# EAGLE schematic TMC2130-Eval_v13 (EAGLE 6.2)

## Sheet 1 of 2
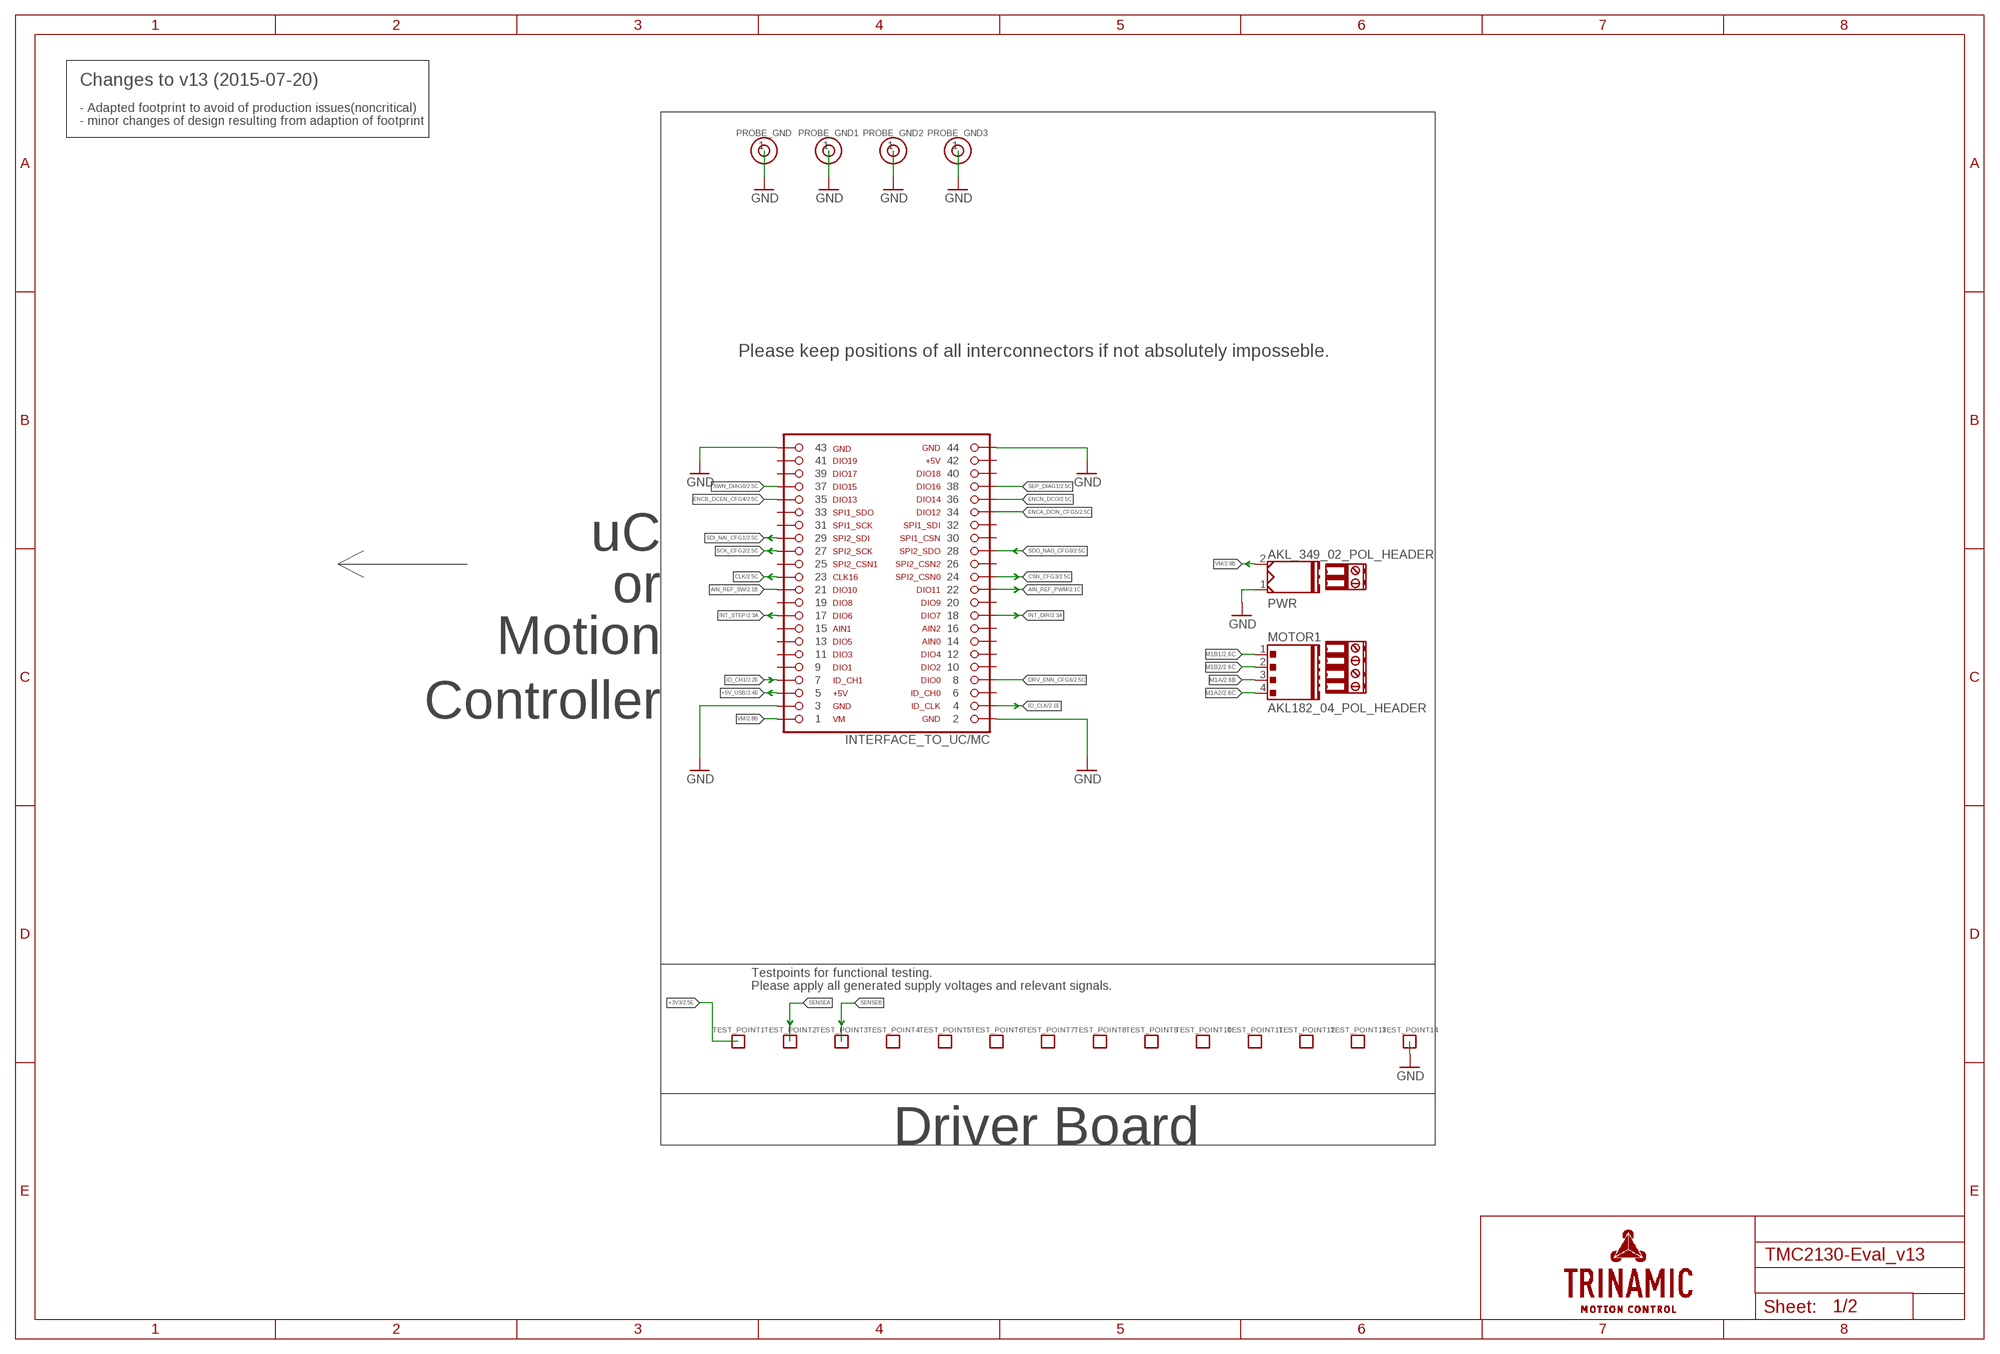
[diagram p0: schematic, sheet 1]

### Parts
INTERFACE_TO_UC/MC  FEMALE_HEADER_SMD_2.54_44_PINSHORTPADS_HOLES  [FEMALE_HEADER_SMD_254_44_PIN_SHORTPADS_HOLES]
MOTOR1  AKL182_04_POL_HEADER  [AKL169_04_POL]
PROBE_GND  NOT ASSEMBLED  1PIN_1ROW  [1PIN_1ROW_THT]
PROBE_GND1  NOT ASSEMBLED  1PIN_1ROW  [1PIN_1ROW_THT]
PROBE_GND2  NOT ASSEMBLED  1PIN_1ROW  [1PIN_1ROW_THT]
PROBE_GND3  NOT ASSEMBLED  1PIN_1ROW  [1PIN_1ROW_THT]
PWR  AKL_349_02_POL_HEADER  [AKL349_02_POL]
TERM1  AKL_330_2_POL_TERMINAL  [EXTRA_TERMINAL]
TERM2  AKL182_04_POL_TERMINAL  [EXTRA_TERMINAL]
TEST_POINT1  NOT ASSEMBLED  PAD_ROUND  [PAD_R1.2]
TEST_POINT2  NOT ASSEMBLED  PAD_ROUND  [PAD_R1.2]
TEST_POINT3  NOT ASSEMBLED  PAD_ROUND  [PAD_R1.2]
TEST_POINT4  NOT ASSEMBLED  PAD_ROUND  [PAD_R1.2]
TEST_POINT5  NOT ASSEMBLED  PAD_ROUND  [PAD_R1.2]
TEST_POINT6  NOT ASSEMBLED  PAD_ROUND  [PAD_R1.2]
TEST_POINT7  NOT ASSEMBLED  PAD_ROUND  [PAD_R1.2]
TEST_POINT8  NOT ASSEMBLED  PAD_ROUND  [PAD_R1.2]
TEST_POINT9  NOT ASSEMBLED  PAD_ROUND  [PAD_R1.2]
TEST_POINT10  NOT ASSEMBLED  PAD_ROUND  [PAD_R1.2]
TEST_POINT11  NOT ASSEMBLED  PAD_ROUND  [PAD_R1.2]
TEST_POINT12  NOT ASSEMBLED  PAD_ROUND  [PAD_R1.2]
TEST_POINT13  NOT ASSEMBLED  PAD_ROUND  [PAD_R1.2]
TEST_POINT14  NOT ASSEMBLED  PAD_ROUND  [PAD_R1.2]

### Nets
+3V3: TEST_POINT1.P$1 ; also sheet 2
+5V_USB: INTERFACE_TO_UC/MC.5 ; also sheet 2
AIN_REF_PWM: INTERFACE_TO_UC/MC.22 ; also sheet 2
AIN_REF_SW: INTERFACE_TO_UC/MC.21 ; also sheet 2
CLK: INTERFACE_TO_UC/MC.23 ; also sheet 2
CSN_CFG3: INTERFACE_TO_UC/MC.24 ; also sheet 2
DRV_ENN_CFG6: INTERFACE_TO_UC/MC.8 ; also sheet 2
ENCA_DCIN_CFG5: INTERFACE_TO_UC/MC.34 ; also sheet 2
ENCB_DCEN_CFG4: INTERFACE_TO_UC/MC.35 ; also sheet 2
ENCN_DCO: INTERFACE_TO_UC/MC.36 ; also sheet 2
GND: INTERFACE_TO_UC/MC.2 INTERFACE_TO_UC/MC.3 INTERFACE_TO_UC/MC.43 INTERFACE_TO_UC/MC.44 PROBE_GND1.1 PROBE_GND2.1 PROBE_GND3.1 PROBE_GND.1 PWR.1 TEST_POINT14.P$1 ; also sheet 2
ID_CH1: INTERFACE_TO_UC/MC.7 ; also sheet 2
ID_CLK: INTERFACE_TO_UC/MC.4 ; also sheet 2
INT_DIR: INTERFACE_TO_UC/MC.18 ; also sheet 2
INT_STEP: INTERFACE_TO_UC/MC.17 ; also sheet 2
M1A: MOTOR1.3 ; also sheet 2
M1A2: MOTOR1.4 ; also sheet 2
M1B1: MOTOR1.1 ; also sheet 2
M1B2: MOTOR1.2 ; also sheet 2
SCK_CFG2: INTERFACE_TO_UC/MC.27 ; also sheet 2
SDI_NAI_CFG1: INTERFACE_TO_UC/MC.29 ; also sheet 2
SDO_NAO_CFG0: INTERFACE_TO_UC/MC.28 ; also sheet 2
SENSEA: TEST_POINT2.P$1 ; also sheet 2
SENSEB: TEST_POINT3.P$1 ; also sheet 2
SEP_DIAG1: INTERFACE_TO_UC/MC.38 ; also sheet 2
SWN_DIAG0: INTERFACE_TO_UC/MC.37 ; also sheet 2
VM: INTERFACE_TO_UC/MC.1 PWR.2 ; also sheet 2
Unconnected: INTERFACE_TO_UC/MC.6 INTERFACE_TO_UC/MC.9 INTERFACE_TO_UC/MC.10 INTERFACE_TO_UC/MC.11 INTERFACE_TO_UC/MC.12 INTERFACE_TO_UC/MC.13 INTERFACE_TO_UC/MC.14 INTERFACE_TO_UC/MC.15 INTERFACE_TO_UC/MC.16 INTERFACE_TO_UC/MC.19 INTERFACE_TO_UC/MC.20 INTERFACE_TO_UC/MC.25 INTERFACE_TO_UC/MC.26 INTERFACE_TO_UC/MC.30 INTERFACE_TO_UC/MC.31 INTERFACE_TO_UC/MC.32 INTERFACE_TO_UC/MC.33 INTERFACE_TO_UC/MC.39 INTERFACE_TO_UC/MC.40 INTERFACE_TO_UC/MC.41 INTERFACE_TO_UC/MC.42 TEST_POINT4.P$1 TEST_POINT5.P$1 TEST_POINT6.P$1 TEST_POINT7.P$1 TEST_POINT8.P$1 TEST_POINT9.P$1 TEST_POINT10.P$1 TEST_POINT11.P$1 TEST_POINT12.P$1 TEST_POINT13.P$1

### Notes on the sheet
- Changes to v13 (2015-07-20)
- - Adapted footprint to avoid of production issues(noncritical)
- - minor changes of design resulting from adaption of footprint
- Please keep positions of all interconnectors if not absolutely imposseble.
- uC
- or
- Motion
- Controller
- Testpoints for functional testing.
- Please apply all generated supply voltages and relevant signals.
- Driver Board

## Sheet 2 of 2
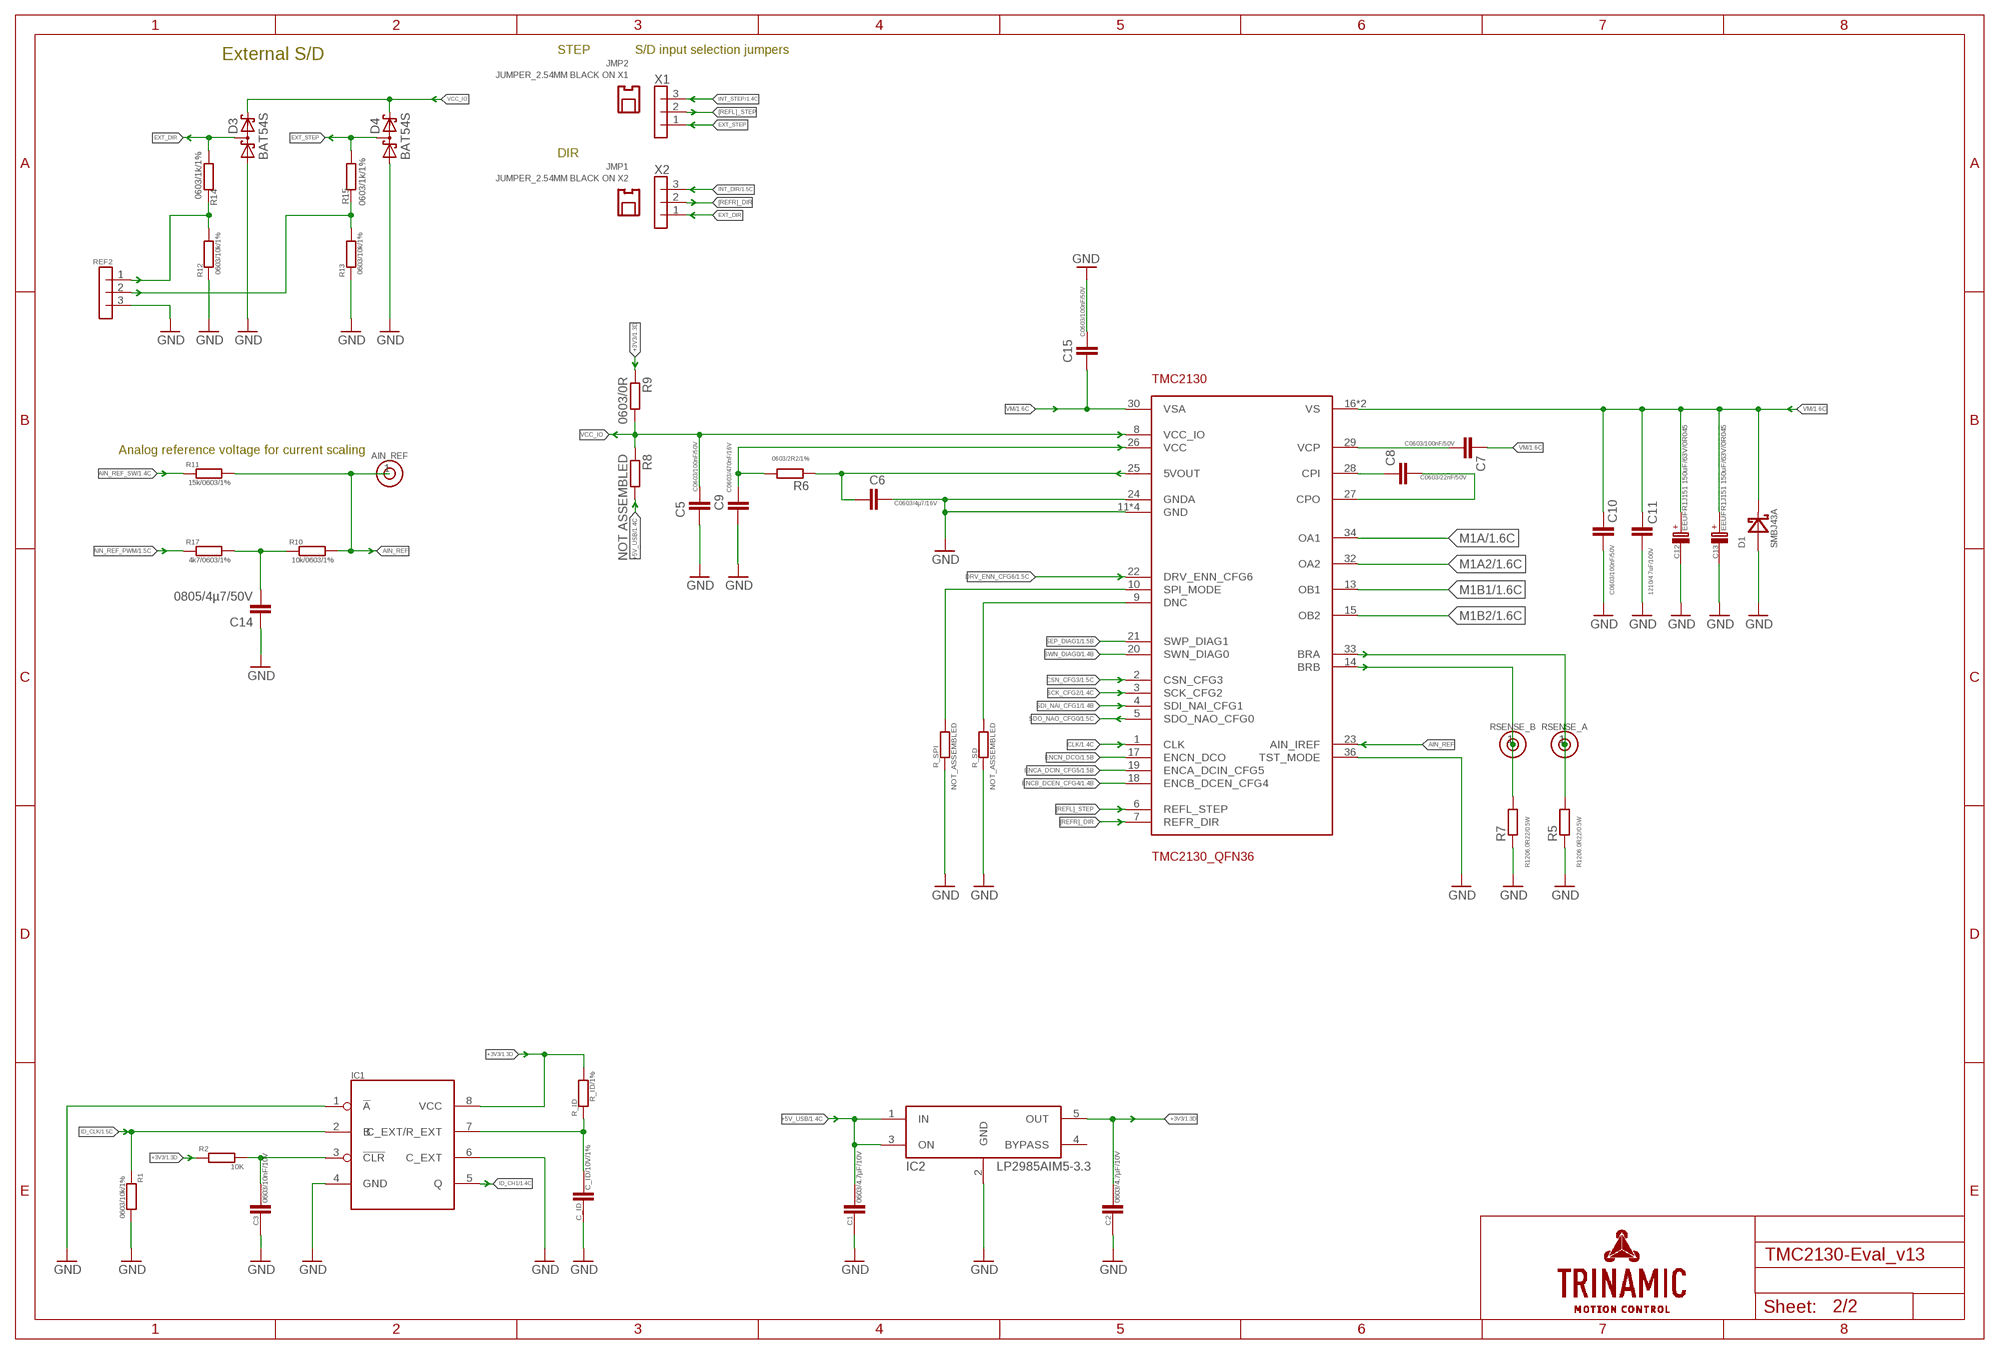
[diagram p1: schematic, sheet 2]

### Parts
AIN_REF  NOT ASSEMBLED  1PIN_1ROW  [1PIN_1ROW_THT]
C1  0603/4.7µF/10V  RCL_C/0603  [RCL_0603]
C2  0603/4.7µF/10V  RCL_C/0603  [RCL_0603]
C3  0603/10nF/10V  RCL_C/0603  [RCL_0603]
C5  C0603/100nF/50V  C-EUC0603  [C0603]
C6  C0603/4µ7/16V  C-EUC0603  [C0603]
C7  C0603/100nF/50V  C-EUC0603  [C0603]
C8  C0603/22nF/50V  C-EUC0603  [C0603]
C9  C0603/470nF/16V  C-EUC0603  [C0603]
C10  C0603/100nF/50V  C-EUC0603  [C0603]
C11  1210/4.7uF/100V  C-EUC1210  [C1210]
C12  EEUFR1J151 150uF/63V/0R045  C_POL  [C_POL_RAD_THT_5X10X12.5]
C13  EEUFR1J151 150uF/63V/0R045  C_POL  [C_POL_RAD_THT_5X10X12.5]
C14  0805/4µ7/50V  C-EUC0805  [C0805]
C15  C0603/100nF/50V  C-EUC0603  [C0603]
C_ID  C_ID/10V/1%  RCL_C/0603  [RCL_0603]
D1  SMBJ43A  SMBJ  [SMB]
D3  BAT54S  [SOT23]
D4  BAT54S  [SOT23]
IC1  SN74LVC1G123DCTR  [SN74LVC1G123DCTR]
IC2  LP2985AIM5-3.3  [SOT23-5]
JMP1  JUMPER_2.54MM BLACK ON X2  JUMPER_2.54MM  [EXTRA_TERMINAL]
JMP2  JUMPER_2.54MM BLACK ON X1  JUMPER_2.54MM  [EXTRA_TERMINAL]
R1  0603/10k/1%  RCL_R/0603  [RCL_0603]
R2  10K  RCL_R/0603  [RCL_0603]
R5  R1206,0R22/0.5W  R-EU_R1206  [R1206]
R6  0603/2R2/1%  R-EU_R0603  [R0603]
R7  R1206,0R22/0.5W  R-EU_R1206  [R1206]
R8  NOT ASSEMBLED  R-EU_R0603  [R0603]
R9  0603/0R  R-EU_R0603  [R0603]
R10  10k/0603/1%  RCL_R/0603  [RCL_0603]
R11  15k/0603/1%  RCL_R/0603  [RCL_0603]
R12  0603/10k/1%  R/0603  [0603]
R13  0603/10k/1%  R/0603  [0603]
R14  0603/1k/1%  R/0603  [0603]
R15  0603/1k/1%  R/0603  [0603]
R17  4k7/0603/1%  RCL_R/0603  [RCL_0603]
R_ID  R_ID/1%  RCL_R/0603  [RCL_0603]
R_SD  NOT_ASSEMBLED  RCL_R/0603  [RCL_0603]
R_SPI  NOT_ASSEMBLED  RCL_R/0603  [RCL_0603]
REF2  MALE HEADER 2.54  3PIN_1ROWTHT  [3PIN_1ROW_2,54_THT]
RSENSE_A  NOT ASSEMBLED  1PIN_1ROW  [1PIN_1ROW_THT]
RSENSE_B  NOT ASSEMBLED  1PIN_1ROW  [1PIN_1ROW_THT]
TMC2130  TMC2130_QFN36  [QFN36]
X1  MALE HEADER 2.54  3PIN_1ROWTHT  [3PIN_1ROW_2,54_THT]
X2  MALE HEADER 2.54  3PIN_1ROWTHT  [3PIN_1ROW_2,54_THT]

### Nets
+3V3: C2.1 IC1.8(VCC) IC2.5(OUT) R2.1 R9.1 R_ID.2 ; also sheet 1
+5V_USB: C1.1 IC2.1(IN) IC2.3(ON) R8.2 ; also sheet 1
[REFL]_STEP: TMC2130.6(REFL_STEP) X1.2
[REFR]_DIR: TMC2130.7(REFR_DIR) X2.2
AIN_REF: AIN_REF.1 R10.2 R11.2 TMC2130.23(AIN_IREF)
AIN_REF_PWM: R17.1 ; also sheet 1
AIN_REF_SW: R11.1 ; also sheet 1
CLK: TMC2130.1(CLK) ; also sheet 1
CSN_CFG3: TMC2130.2(CSN_CFG3) ; also sheet 1
DRV_ENN_CFG6: TMC2130.22(DRV_ENN_CFG6) ; also sheet 1
ENCA_DCIN_CFG5: TMC2130.19(ENCA_DCIN_CFG5) ; also sheet 1
ENCB_DCEN_CFG4: TMC2130.18(ENCB_DCEN_CFG4) ; also sheet 1
ENCN_DCO: TMC2130.17(ENCN_DCO) ; also sheet 1
EXT_DIR: D3.3(C1A2) R14.2 X2.1
EXT_DIR_CON: R12.2 R14.1 REF2.1
EXT_STEP: D4.3(C1A2) R15.2 X1.1
EXT_STEP_CON: R13.2 R15.1 REF2.2
GND: C1.2 C2.2 C3.2 C5.2 C6.2 C9.1 C10.1 C11.2 C12.- C13.- C14.1 C15.1 C_ID.2 D1.A D3.1(A1) D4.1(A1) IC1.1(!A) IC1.4(GND) IC1.6(C_EXT) IC2.2(GND) R1.2 R5.1 R7.1 R12.1 R13.1 R_SD.1 R_SPI.1 REF2.3 TMC2130.11(GND) TMC2130.12(GND) TMC2130.24(GNDA) TMC2130.35(GND) TMC2130.36(TST_MODE) TMC2130.GND_PAD(GND) ; also sheet 1
ID_CH1: IC1.5(Q) ; also sheet 1
ID_CLK: IC1.2(B) R1.1 ; also sheet 1
INT_DIR: X2.3 ; also sheet 1
INT_STEP: X1.3 ; also sheet 1
M1A: TMC2130.34(OA1) ; also sheet 1
M1A2: TMC2130.32(OA2) ; also sheet 1
M1B1: TMC2130.13(OB1) ; also sheet 1
M1B2: TMC2130.15(OB2) ; also sheet 1
N$1: C3.1 IC1.3(!CLR) R2.2
N$2: C_ID.1 IC1.7(C_EXT/R_EXT) R_ID.1
N$3: R_SPI.2 TMC2130.10(SPI_MODE)
N$5: R_SD.2 TMC2130.9(DNC)
N$7: C6.1 R6.1 TMC2130.25(5VOUT)
N$8: C8.1 TMC2130.28(CPI)
N$9: C8.2 TMC2130.27(CPO)
N$10: C7.2 TMC2130.29(VCP)
N$11: C9.2 R6.2 TMC2130.26(VCC)
N$14: C14.2 R10.1 R17.2
SCK_CFG2: TMC2130.3(SCK_CFG2) ; also sheet 1
SDI_NAI_CFG1: TMC2130.4(SDI_NAI_CFG1) ; also sheet 1
SDO_NAO_CFG0: TMC2130.5(SDO_NAO_CFG0) ; also sheet 1
SENSEA: R5.2 RSENSE_A.1 TMC2130.33(BRA) ; also sheet 1
SENSEB: R7.2 RSENSE_B.1 TMC2130.14(BRB) ; also sheet 1
SEP_DIAG1: TMC2130.21(SWP_DIAG1) ; also sheet 1
SWN_DIAG0: TMC2130.20(SWN_DIAG0) ; also sheet 1
VCC_IO: C5.1 D3.2(C2) D4.2(C2) R8.1 R9.2 TMC2130.8(VCC_IO)
VM: C7.1 C10.2 C11.1 C12.+ C13.+ C15.2 D1.C TMC2130.16(VS) TMC2130.30(VSA) TMC2130.31(VS) ; also sheet 1
Unconnected: IC2.4(BYPASS)

### Notes on the sheet
- STEP | S/D input selection jumpers
- External S/D
- DIR
- Analog reference voltage for current scaling

## Library data of the parts
AIN_REF PROBE_GND PROBE_GND1-PROBE_GND3 RSENSE_A RSENSE_B = _TMC_TE_con:1PIN_1ROW
C1-C3 C_ID = TMC_EVAL_driver_TE_v01:RCL_C
C5-C11 C14 C15 = rcl:C-EU: CAPACITOR, European symbol
C12 C13 = _TMC_TE_RCL:C_POL
D1 = _TMC_TE_D:SMBJ
D3 D4 = Trinamic:BAT54S: SOT23, BAT54S, Double Schottky diode 30V 200mA Copied from diode.lbr and edited for Artec use 23-08-13 Pin connection corrected 2011-05-04 Source: Fairchild .. BAT54.pdf; ADGPN: 3522154300; DATASHEET: http://www.nxp.com/documents/data_sheet/BAT54_SERIES.pdf; MANUF-CODE-1: BAT54S; MANUFACTURER-1: Philips; PRICE: 0.11
IC1 = TMC_EVAL_driver_TE_v01:SN74LVC1G123DCTR
IC2 = TMC_EVAL_driver_TE_v01:LP2985AIM5-3.3
INTERFACE_TO_UC/MC = _TMC_TE_con:FEMALE_HEADER_SMD_2.54_44_PIN; 1_PARTNUMBER: 098-3-044-1-NFX-YT0; 1_SUPPLIER: MPE Garry; 2_PARTNUMBER: HLE-122-02-F-DV-A; 2_SUPPLIER: Samtec
JMP1 JMP2 = _TMC_TE_con:JUMPER_2.54MM: Jumper 2.54mm, Open top, h6.5mm, black Datasheet <http://www.tme.eu/en/Document/d9e6fb6fc4dc34d59ba745016c42e7c7/jumper.pdf>
MOTOR1 = _TMC_TE_con:AKL182_04_POL_HEADER: AKL header, shrouted, 4 pins; 1_PARTNUMBER: 31182104; 1_SUPPLIER: RIA CONNECT; 2_PARTNUMBER: AKL 182-04; 2_SUPPLIER: Reichelt
PWR = _TMC_TE_con:AKL_349_02_POL_HEADER: AKL header, shrouted, 2 pins; 1_PARTNUMBER: 31330102; 1_SUPPLIER: RIA CONNECT; 2_PARTNUMBER: AKL 330-02; 2_SUPPLIER: REICHELT
R1 R2 R10 R11 R17 R_ID R_SD R_SPI = TMC_EVAL_driver_TE_v01:RCL_R
R5-R9 = rcl:R-EU_: RESISTOR, European symbol
R12-R15 = _TMC_TE_RCL:R
REF2 X1 X2 = _TMC_TE_con:3PIN_1ROW
TERM1 = _TMC_TE_con:AKL_330_2_POL_TERMINAL: AKL terminal, 2 pins; 1_PARTNUMBER: 31349102; 1_SUPPLIER: RIA CONNECT; 2_PARTNUMBER: AKL 349-02; 2_SUPPLIER: Reichelt
TERM2 = _TMC_TE_con:AKL182_04_POL_TERMINAL: AKL terminal, 4 pins; 1_PARTNUMBER: 31169104; 1_SUPPLIER: RIA CONNECT; 2_PARTNUMBER: AKL 169-04; 2_SUPPLIER: Reichelt
TEST_POINT1-TEST_POINT14 = _TMC_TE_PADS:PAD_ROUND
TMC2130 = Trinamic:TMC2130_QFN36

## Net classes
0 default: width 0.254 mm, drill 0.3 mm